# Altium project THC.PrjPcb
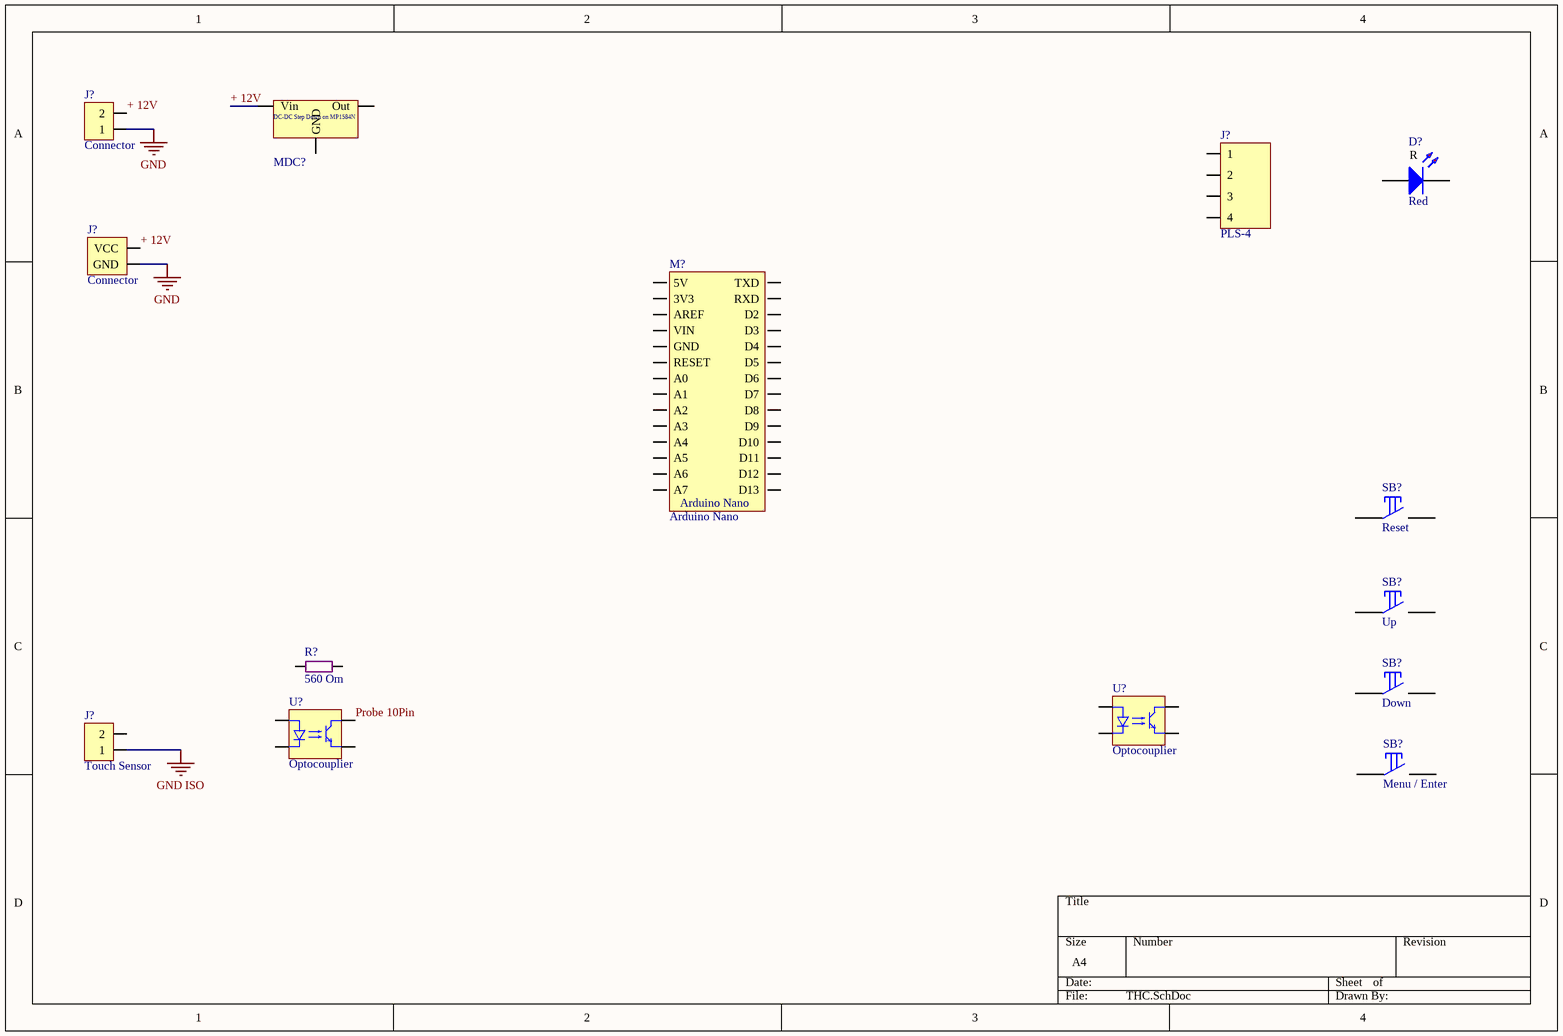
[diagram p0: THC.SchDoc]
1 sheet, 14 parts. Net scope: global (net labels, ports and power ports of the same name join across sheets).
Board file: 100 x 50 mm  v2.PcbDoc

## Sheet THC.SchDoc
size A4

### Parts
(Parts that share a designator on the sheet are numbered #1, #2 ... from top to bottom, then left to right.)
D?  Red  [LED Round 5mm red]
J?#1  Connector  [TBC 5.08 - 2R]
J?#2  PLS-4  [Line 2.54 X 4]
J?#3  Connector  [DC Connector]
J?#4  Touch Sensor  [TBC 5.08 - 2R]
M?  Arduino Nano  [Arduino Nano]
MDC?  DC-DC  [DC-DC_MP1584N]  (value not drawn)
R?  560 Om  [SMD 0805 (2012)]
SB?#1  Reset  [Switch Button 4P]
SB?#2  Up  [Switch Button 4P]
SB?#3  Down  [Switch Button 4P]
SB?#4  Menu / Enter  [Switch Button 4P]
U?#1  Optocouplier  [DIP-4 SMD]
U?#2  Optocouplier  [DIP-4 SMD]

### Nets
GND: J?#1.1 J?#3.GND
GND ISO: J?#4.1
+ 12V: J?#1.2 J?#3.VCC MDC?.IN(Vin)
Probe 10Pin: U?#2.3

Not connected (* = marked no-connect by the designer): D? A K; J?#2 1 2 3 4; J?#4 2; M? 3V3 5V A0 A1 A2 A3 A4 A5 A6 A7 AREF D2 D3 D4 D5 D6 D7 D8 D9 D10 D11 D12 D13 GND RESET RXD TXD VIN; MDC? GND OUT(Out); R? 1 2; SB?#1 1 2; SB?#2 1 2; SB?#3 1 2; SB?#4 1 2; U?#1 1 2 3 4; U?#2 1 2 4

### Notes on the sheet
- (in symbol DC-DC MP1584N) DC-DC Step Down on MP1584N
- (in symbol Led Round 5mm Red) R

### Library data of the parts
D? = Led Round 5mm Red: 1.8-2v 20mA, 4-5cd; Forward Voltage Min: 1.8; Forward Voltage TYP: 2; Wave len min/typ: 615/625; Liminous Min (mcd): 4000; Liminous Typ (mcd): 5000; Forward Amp (mA): 20; Color: Red
J?#1 J?#4 = TBC - 5.08 - 2: Terminal Block 5.08
J?#2 = PLS-4: Vert, Sgl line, Male
J?#3 = DC Connector (PJ-002B): DC Connector; Ext Pin Diameter: 5.5mm; Int Pin Diameter: 2.5
MDC? = DC-DC MP1584N: DC-DC StepDown
R? = Res SMD 0805
SB?#1-SB?#4 = Button: Tact button
U?#1 U?#2 = Optocouplier LTV 817B: LTV817 Datasheet: http://lib.chipdip.ru/222/DOC000222300.pdf; Name: LTV817B